# EAGLE schematic NanjaTown (EAGLE 9.1.0)
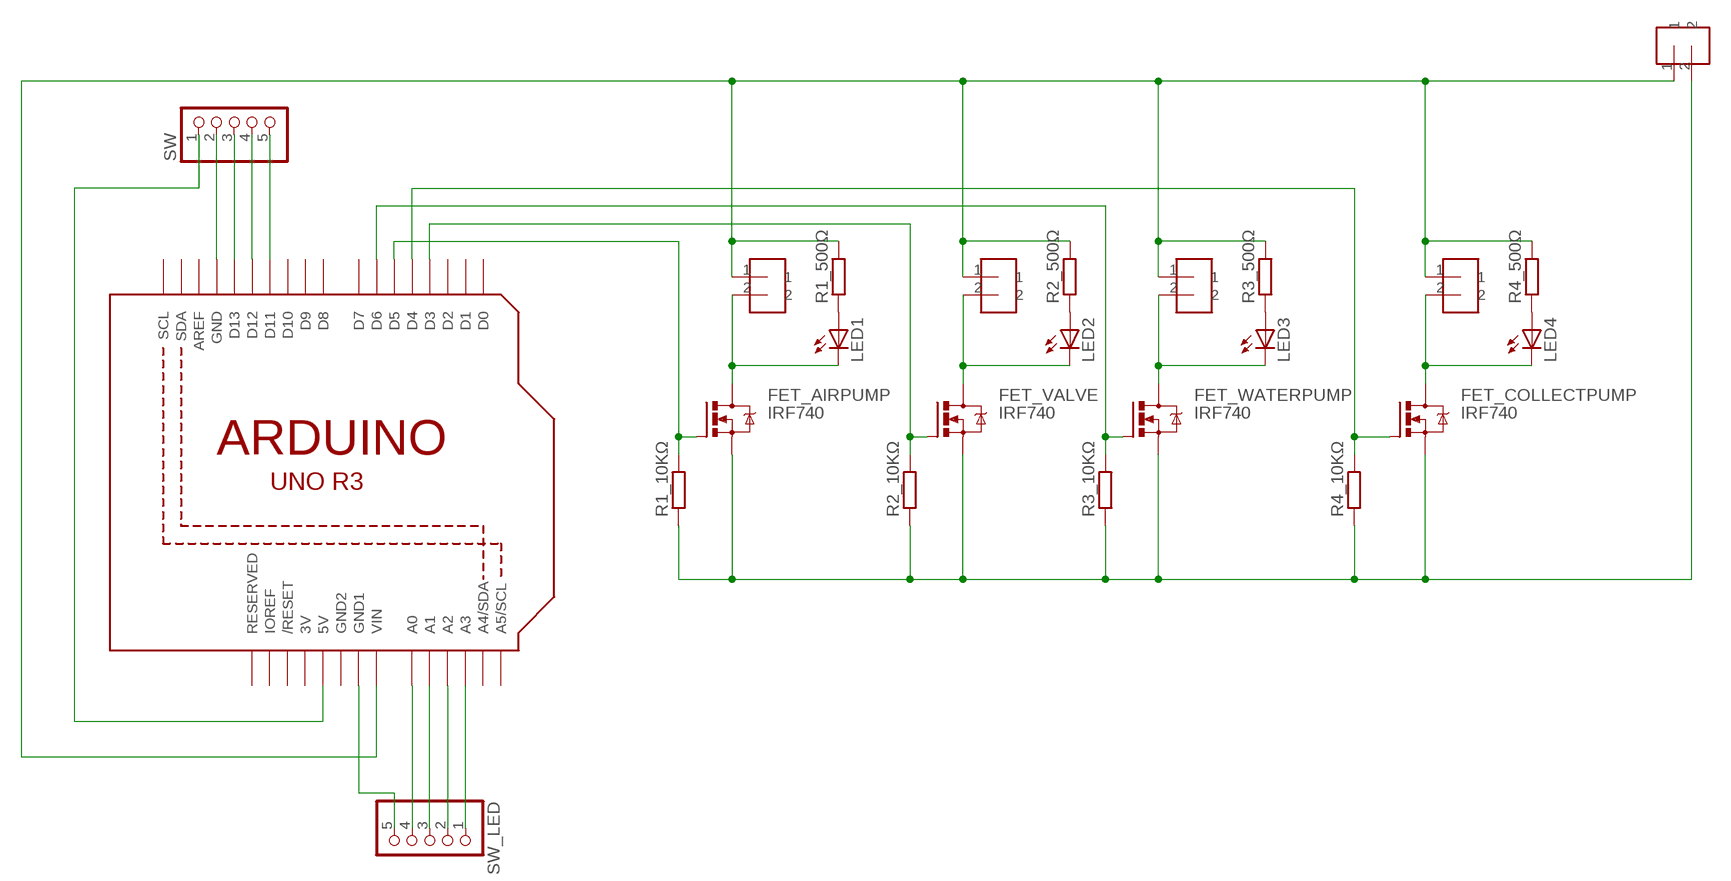
[diagram p0: schematic, sheet 1]

## Parts
FET_AIRPUMP  IRF740  [TO220BV]
FET_COLLECTPUMP  IRF740  [TO220BV]
FET_VALVE  IRF740  [TO220BV]
FET_WATERPUMP  IRF740  [TO220BV]
LED1  LEDB156  [Q62902-B156]
LED2  LEDB156  [Q62902-B156]
LED3  LEDB156  [Q62902-B156]
LED4  LEDB156  [Q62902-B156]
R1_10KΩ  R-EU_0207/10  [0207/10]
R1_500Ω  R-EU_0207/10  [0207/10]
R2_10KΩ  R-EU_0207/10  [0207/10]
R2_500Ω  R-EU_0207/10  [0207/10]
R3_10KΩ  R-EU_0207/10  [0207/10]
R3_500Ω  R-EU_0207/10  [0207/10]
R4_10KΩ  R-EU_0207/10  [0207/10]
R4_500Ω  R-EU_0207/10  [0207/10]
SW  PINHD-1X5  [1X05]
SW_LED  PINHD-1X5/90  [1X05/90]
TERMINAL_AIRPUMP  TERMINAL_BLOCK_5.08MM  [TERMINAL_BLOCK_5.8MM]
TERMINAL_COLLECTPUMP  TERMINAL_BLOCK_5.08MM  [TERMINAL_BLOCK_5.8MM]
TERMINAL_VALVE  TERMINAL_BLOCK_5.08MM  [TERMINAL_BLOCK_5.8MM]
TERMINAL_WATERPUMP  TERMINAL_BLOCK_5.08MM  [TERMINAL_BLOCK_5.8MM]
U1  ARDUINOR3-DIMENSION  [ARDUINOR3]
VCC_12V  TERMINAL_BLOCK_5.08MM  [TERMINAL_BLOCK_5.8MM]

## Nets
N$1: FET_AIRPUMP.G R1_10KΩ.2 U1.D5
N$2: FET_VALVE.G R2_10KΩ.2 U1.D3
N$3: FET_WATERPUMP.G R3_10KΩ.2 U1.D6
N$4: FET_COLLECTPUMP.G R4_10KΩ.2 U1.D4
N$5: FET_AIRPUMP.S FET_COLLECTPUMP.S FET_VALVE.S FET_WATERPUMP.S R1_10KΩ.1 R2_10KΩ.1 R3_10KΩ.1 R4_10KΩ.1 VCC_12V.2
N$6: R1_500Ω.2 R2_500Ω.2 R3_500Ω.2 R4_500Ω.2 TERMINAL_AIRPUMP.1 TERMINAL_COLLECTPUMP.1 TERMINAL_VALVE.1 TERMINAL_WATERPUMP.1 U1.VIN VCC_12V.1
N$7: FET_AIRPUMP.D LED1.K(C) TERMINAL_AIRPUMP.2
N$8: FET_VALVE.D LED2.K(C) TERMINAL_VALVE.2
N$9: FET_WATERPUMP.D LED3.K(C) TERMINAL_WATERPUMP.2
N$10: FET_COLLECTPUMP.D LED4.K(C) TERMINAL_COLLECTPUMP.2
N$11: SW_LED.4 U1.A0
N$12: SW_LED.3 U1.A1
N$13: SW_LED.2 U1.A2
N$14: SW_LED.1 U1.A3
N$15: SW_LED.5 U1.GND1
N$16: SW.5 U1.D11
N$17: SW.4 U1.D12
N$18: SW.3 U1.D13
N$19: SW.2 U1.GND
N$20: SW.1 U1.5V
N$21: LED1.A R1_500Ω.1
N$22: LED2.A R2_500Ω.1
N$23: LED3.A R3_500Ω.1
N$24: LED4.A R4_500Ω.1
Unconnected: U1.A4(A4/SDA) U1.A5(A5/SCL) U1.AREF U1.D0 U1.D1 U1.D2 U1.D7 U1.D8 U1.D9 U1.D10 U1.IOREF U1.RESERVED U1.RESET(/RESET) U1.SCL U1.SDA

## Power pins joined to a net without a drawn wire
3V: U1.3V
GND2: U1.GND2

## Library data of the parts
FET_AIRPUMP FET_COLLECTPUMP FET_VALVE FET_WATERPUMP = transistor-power:IRF740: N-CHANNEL MOS FET
LED1-LED4 = adafruit:LED: LED OSRAM: - CHIPLED LG R971, LG N971, LY N971, LG Q971, LY Q971, LO R971, LY R971 LH N974, LH R974 LS Q976, LO Q976, LY Q976 LO Q996 - Hyper CHIPLED LW Q18S LB Q993, LB Q99A, LB R99A - SideLED LS A670, LO A670, LY A670, LG A670, LP A670 LB A673, LV A673, LT A673, LW A673 LH A674 LY A675 LS A676, LA A676, LO A676, LY A676, LW A676 LS A679, LY A679, LG A679 - Hyper Micro SIDELED® LS Y876, LA Y876, LO Y876, LY Y876 LT Y87S - SmartLED LW L88C, LW L88S LB L89C, LB L89S, LG L890 LS L89K, LO L89K, LY L89K LS L896, LA L896, LO L896, LY L896 - TOPLED LS T670, LO T670, LY T670, LG T670, LP T670 LSG T670, LSP T670, LSY T670, LOP T670, LYG T670 LG T671, LOG T671, LSG T671 LB T673, LV T673, LT T673, LW T673 LH T674 LS T676, LA T676, LO T676, LY T676, LB T676, LH T676, LSB T676, LW T676 LB T67C, LV T67C, LT T67C, LS T67K, LO T67K, LY T67K, LW E67C LS E67B, LA E67B, LO E67B, LY E67B, LB E67C, LV E67C, LT E67C LW T67C LS T679, LY T679, LG T679 LS T770, LO T770, LY T770, LG T770, LP T770 LB T773, LV T773, LT T773, LW T773 LH T774 LS E675, LA E675, LY E675, LS T675 LS T776, LA T776, LO T776, LY T776, LB T776 LHGB T686 LT T68C, LB T68C - Hyper Mini TOPLED® LB M676 - Mini TOPLED Santana® LG M470 LS M47K, LO M47K, LY M47K Source: http://www.osram.convergy.de/
R1_10KΩ R1_500Ω R2_10KΩ R2_500Ω R3_10KΩ R3_500Ω R4_10KΩ R4_500Ω = rcl:R-EU_: RESISTOR, European symbol; SPICEPREFIX: R
SW SW_LED = pinhead:PINHD-1X5: PIN HEADER
TERMINAL_AIRPUMP TERMINAL_COLLECTPUMP TERMINAL_VALVE TERMINAL_WATERPUMP VCC_12V = terminal_block_5.08mm:TERMINAL_BLOCK_5.08MM
U1 = adafruit:ARDUINOR3: This is a new object for the new Arduino R3 - with extra pins that you may want to use (such as IOref, and duplicated A4/A5

## Net classes
0 default: width 1 mm, clearance 1 mm